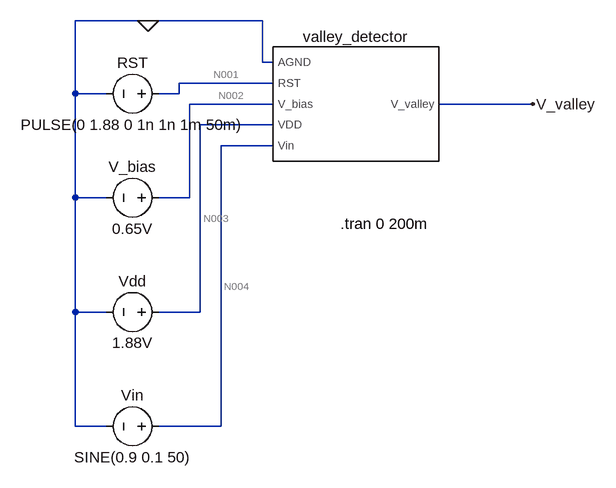
[diagram p0: schematic valley_detector_test.asc]
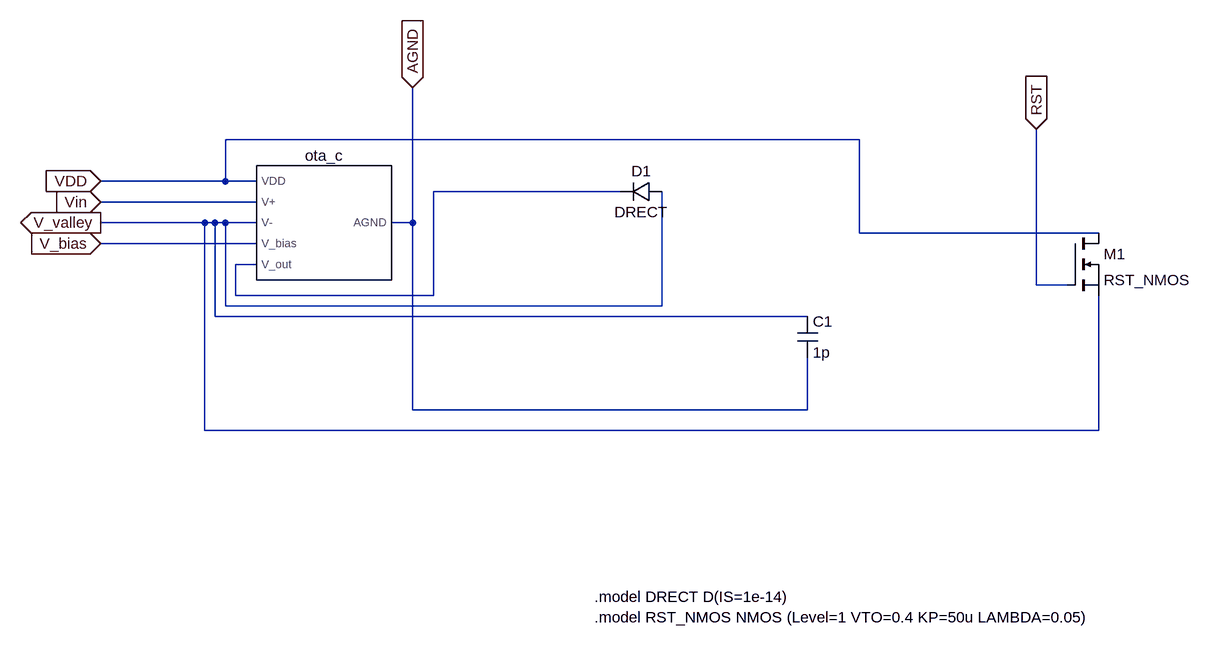
[diagram p1: sub-circuit valley_detector.asc]
valley_detector_test.asc, the LTspice schematic file:
Version 4.1
SHEET 1 880 736
WIRE -80 48 -192 48
WIRE 96 48 -80 48
WIRE 96 112 96 48
WIRE 112 112 96 112
WIRE 112 144 -32 144
WIRE -192 160 -192 48
WIRE -144 160 -192 160
WIRE -32 160 -32 144
WIRE -32 160 -64 160
WIRE 112 176 -16 176
WIRE 512 176 368 176
WIRE 112 208 0 208
WIRE 112 240 32 240
WIRE -192 320 -192 160
WIRE -144 320 -192 320
WIRE -16 320 -16 176
WIRE -16 320 -64 320
WIRE -192 496 -192 320
WIRE -144 496 -192 496
WIRE 0 496 0 208
WIRE 0 496 -64 496
WIRE -192 672 -192 496
WIRE -144 672 -192 672
WIRE 32 672 32 240
WIRE 32 672 -64 672
FLAG -80 48 0
FLAG 512 176 V_valley
SYMBOL voltage -48 160 R90
WINDOW 0 -32 56 VBottom 2
WINDOW 3 32 56 VTop 2
WINDOW 123 0 0 Left 0
WINDOW 39 0 0 Left 0
SYMATTR InstName RST
SYMATTR Value PULSE(0 1.88 0 1n 1n 1m 50m)
SYMBOL voltage -48 320 R90
WINDOW 0 -32 56 VBottom 2
WINDOW 3 32 56 VTop 2
SYMATTR InstName V_bias
SYMATTR Value 0.65V
SYMBOL voltage -48 496 R90
WINDOW 0 -32 56 VBottom 2
WINDOW 3 32 56 VTop 2
SYMATTR InstName Vdd
SYMATTR Value 1.88V
SYMBOL voltage -48 672 R90
WINDOW 0 -32 56 VBottom 2
WINDOW 3 32 56 VTop 2
WINDOW 123 0 0 Left 0
WINDOW 39 0 0 Left 0
SYMATTR InstName Vin
SYMATTR Value SINE(0.9 0.1 50)
SYMBOL valley_detector 240 176 R0
SYMATTR InstName valley_detector
TEXT 216 360 Left 2 !.tran 0 200m

valley_detector.asc, the sub-circuit schematic file:
Version 4.1
SHEET 1 1532 780
WIRE 1024 32 48 32
WIRE 48 96 48 32
WIRE 48 96 -144 96
WIRE 96 96 48 96
WIRE 656 112 368 112
WIRE 96 128 -144 128
WIRE 16 160 -144 160
WIRE 32 160 16 160
WIRE 48 160 32 160
WIRE 96 160 48 160
WIRE 336 160 336 -48
WIRE 336 160 304 160
WIRE 1024 176 1024 32
WIRE 1392 176 1024 176
WIRE 96 192 -144 192
WIRE 96 224 64 224
WIRE 1296 256 1296 16
WIRE 1344 256 1296 256
WIRE 64 272 64 224
WIRE 368 272 368 112
WIRE 368 272 64 272
WIRE 48 288 48 160
WIRE 720 288 720 112
WIRE 720 288 48 288
WIRE 32 304 32 160
WIRE 944 304 32 304
WIRE 336 448 336 160
WIRE 944 448 944 368
WIRE 944 448 336 448
WIRE 16 480 16 160
WIRE 1392 480 1392 272
WIRE 1392 480 16 480
FLAG -144 96 VDD
IOPIN -144 96 In
FLAG -144 128 Vin
IOPIN -144 128 In
FLAG -144 160 V_valley
IOPIN -144 160 Out
FLAG -144 192 V_bias
IOPIN -144 192 In
FLAG 336 -48 AGND
IOPIN 336 -48 In
FLAG 1296 16 RST
IOPIN 1296 16 In
SYMBOL ota_core 192 160 R0
SYMATTR InstName ota_c
SYMBOL diode 720 96 R90
WINDOW 0 0 32 VBottom 2
WINDOW 3 32 32 VTop 2
SYMATTR InstName D1
SYMATTR Value DRECT
SYMBOL cap 928 304 R0
SYMATTR InstName C1
SYMATTR Value 1p
SYMBOL nmos 1344 176 R0
SYMATTR InstName M1
SYMATTR Value RST_NMOS
TEXT 616 736 Left 2 !.model DRECT D(IS=1e-14)\n.model RST_NMOS NMOS (Level=1 VTO=0.4 KP=50u LAMBDA=0.05)

The netlist it stands for:
* valley_detector_test.asc
V§RST N001 0 PULSE(0 1.88 0 1n 1n 1m 50m)
V_bias N002 0 0.65V
Vdd N003 0 1.88V
Vin N004 0 SINE(0.9 0.1 50)
X§valley_detector 0 N001 N002 N003 N004 V_valley valley_detector

* block symbol definitions
.subckt valley_detector AGND RST V_bias VDD Vin V_valley
X§ota_c VDD Vin V_valley V_bias N001 AGND ota_core  ; pins VDD V+ V- V_bias V_out AGND
D1 V_valley N001 DRECT
C1 V_valley AGND 1p
M1 VDD RST V_valley V_valley RST_NMOS
.model DRECT D(IS=1e-14)
.model RST_NMOS NMOS (Level=1 VTO=0.4 KP=50u LAMBDA=0.05)
.ends valley_detector

.model D D
.lib standard.dio
.model NMOS NMOS
.model PMOS PMOS
.lib standard.mos
.tran 0 200m
.backanno
.end

* Results of the author's LTspice run, read from the files saved beside the schematic
* Operating Point, zero values left out:
*   V(n002) = 650 mV
*   V(n003) = 1.88 V
*   V(n004) = 900 mV
*   V(v_valley) = 900.8 mV
*   I(Vdd) = -319.9 nA
*   Ix(valley_detector:agnd) = -319.9 nA
*   Ix(valley_detector:vdd) = 319.9 nA
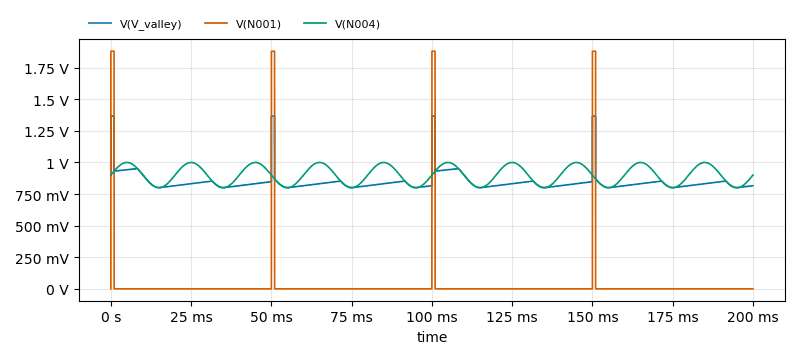
[diagram p2: Transient Analysis of valley_detector_test.asc, plotted from the saved traces]
* Transient Analysis, 1 run:
*   V(V_valley): min 800.9 mV, max 1.367 V, average 845.9 mV, rms 850 mV, last 816.1 mV
*   V(N001): min 0 V, max 1.88 V, average 37.6 mV, rms 265.9 mV, last 0 V
*   V(N004): min 800 mV, max 1 V, average 900 mV, rms 902.8 mV, last 900 mV